# EAGLE design Canzasi-Cont (EAGLE 7.7.0)
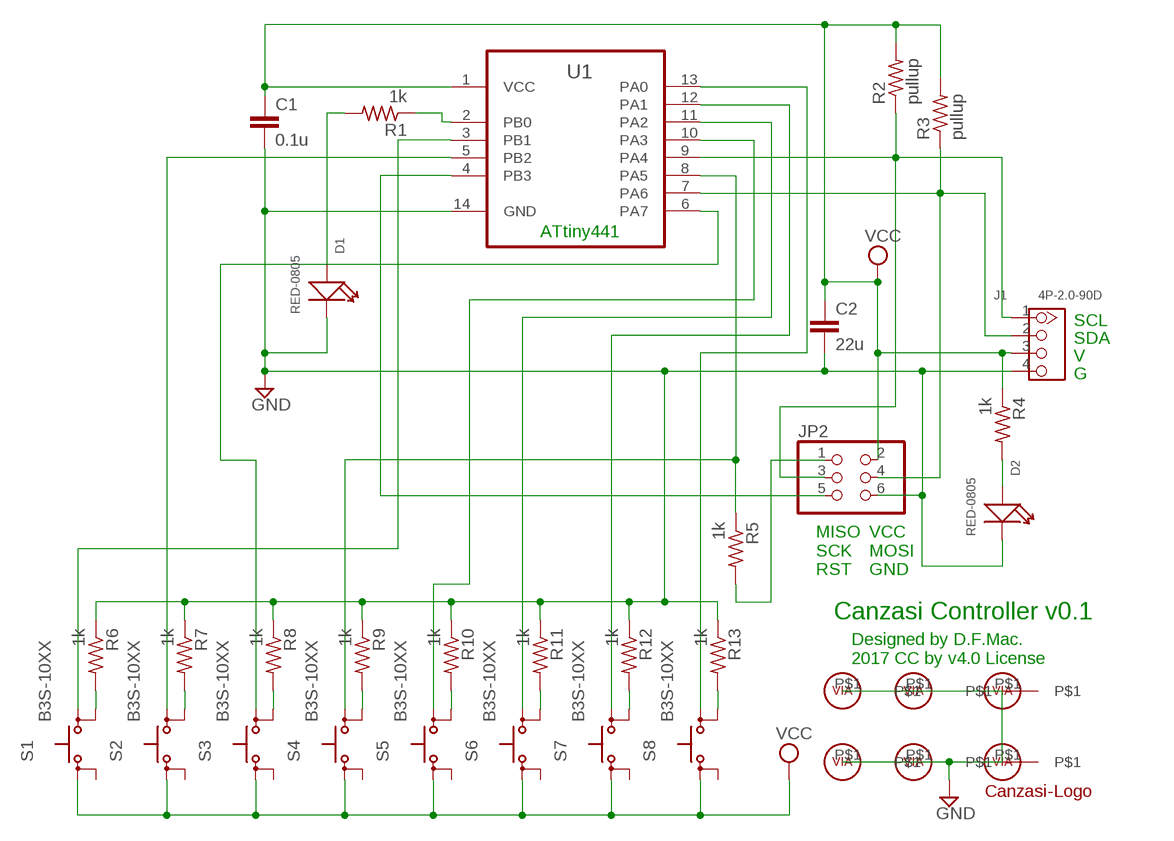
[diagram p0: schematic, sheet 1]

## Parts
C1  0.1u  C-EUC0603  [C0603]
C2  22u  C-EUC0805  [C0805]
D1  RED-0805  SMD-LED-CLEAR-RED(0805)  [LED-0805]
D2  RED-0805  SMD-LED-CLEAR-RED(0805)  [LED-0805]
J1  4P-2.0-90D  GROVE-CONNECTOR-DIP-90D(4P-2.0)  [HW4-2.0-90D]
JP2  PINHD-2X3  [2X03]
R1  1k  R-US_R0603  [R0603]
R2  pullup  R-US_R0603  [R0603]
R3  pullup  R-US_R0603  [R0603]
R4  1k  R-US_R0603  [R0603]
R5  1k  R-US_R0603  [R0603]
R6  1k  R-US_R0603  [R0603]
R7  1k  R-US_R0603  [R0603]
R8  1k  R-US_R0603  [R0603]
R9  1k  R-US_R0603  [R0603]
R10  1k  R-US_R0603  [R0603]
R11  1k  R-US_R0603  [R0603]
R12  1k  R-US_R0603  [R0603]
R13  1k  R-US_R0603  [R0603]
S1  B3S-10XX  [B3S-10XX]
S2  B3S-10XX  [B3S-10XX]
S3  B3S-10XX  [B3S-10XX]
S4  B3S-10XX  [B3S-10XX]
S5  B3S-10XX  [B3S-10XX]
S6  B3S-10XX  [B3S-10XX]
S7  B3S-10XX  [B3S-10XX]
S8  B3S-10XX  [B3S-10XX]
U1  ATTINY44A-SSU  [SOIC127P600X175-14N]
U$1  CANZASI-LOGOMEDIUM  [CANZASI-LOGO-MEDIUM]
U$2  VIA  [VIA]
U$3  VIA  [VIA]
U$4  VIA  [VIA]
U$5  VIA  [VIA]
U$6  VIA  [VIA]
U$7  VIA  [VIA]

## Nets
GND [GND]: C1.2 C2.2 D1.- D2.- J1.4 JP2.6 R6.1 R7.1 R8.1 R9.1 R10.1 R11.1 R12.1 R13.1 U1.14(GND) U$2.P$1 U$3.P$1 U$4.P$1 U$5.P$1 U$6.P$1 U$7.P$1
N$1: R1.1 U1.2(PB0)
N$2: D1.+ R1.2
N$3: J1.2 JP2.4 R3.1 U1.7(PA6)
N$4: J1.1 JP2.3 R2.1 U1.9(PA4)
N$5: S1.3(S) U1.3(PB1)
N$6: S2.3(S) U1.5(PB2)
N$7: JP2.5 U1.4(PB3)
N$8: S3.3(S) U1.6(PA7)
N$9: R5.1 S4.3(S) U1.8(PA5)
N$10: S5.3(S) U1.10(PA3)
N$11: S6.3(S) U1.11(PA2)
N$12: S7.3(S) U1.12(PA1)
N$13: S8.3(S) U1.13(PA0)
N$14: D2.+ R4.2
N$15: JP2.1 R5.2
N$16: R6.2 S1.4(S1)
N$17: R7.2 S2.4(S1)
N$18: R8.2 S3.4(S1)
N$19: R9.2 S4.4(S1)
N$20: R10.2 S5.4(S1)
N$21: R11.2 S6.4(S1)
N$22: R12.2 S7.4(S1)
N$23: R13.2 S8.4(S1)
VCC [VCC]: C1.1 C2.1 J1.3 JP2.2 R2.2 R3.2 R4.1 S1.1(P) S2.1(P) S3.1(P) S4.1(P) S5.1(P) S6.1(P) S7.1(P) S8.1(P) U1.1(VCC)
Unconnected: S1.2(P1) S2.2(P1) S3.2(P1) S4.2(P1) S5.2(P1) S6.2(P1) S7.2(P1) S8.2(P1)

## Notes on the sheet
- ATtiny441
- SCL
- SDA
- V
- G
- MISO
  SCK
  RST
- VCC
  MOSI
  GND
- Canzasi Controller v0.1
- Designed by D.F.Mac.
  2017 CC by v4.0 License

## Library data of the parts
C1 C2 = 0my:C-EU: CAPACITOR, European symbol
D1 D2 = Seeed-OPL-Diode:SMD-LED-CLEAR-RED(0805): 304090046; MPN: 17-215SURC/S530-A2/TR8
J1 = Seeed-OPL-Connector:GROVE-CONNECTOR-DIP-90D(4P-2.0): 320110034
JP2 = 0my:PINHD-2X3: PIN HEADER
R1-R13 = 0my:R-US_: RESISTOR, American symbol
S1-S8 = __switch-omron:B3S-10XX: SMD Tactile Switch
U1 = Atmel_By_element14_Batch_1-00:ATTINY44A-SSU: 8-bit Microcontroller with In-System Programmable Flash; MPN: ATTINY44A-SSU; OC_FARNELL: 1699397; OC_NEWARK: 80P3683; PACKAGE: SOIC-14; SUPPLIER: Atmel
U$1 = 1my:CANZASI-LOGO
U$2-U$7 = 0my:VIA

## Net classes
0 default: width 0.33 mm, drill 0.178 mm, clearance 0.152 mm
1 VCC: width 0.508 mm, drill 0.178 mm, clearance 0.152 mm
2 GND: width 0.508 mm, drill 0.178 mm, clearance 0.152 mm

## Board
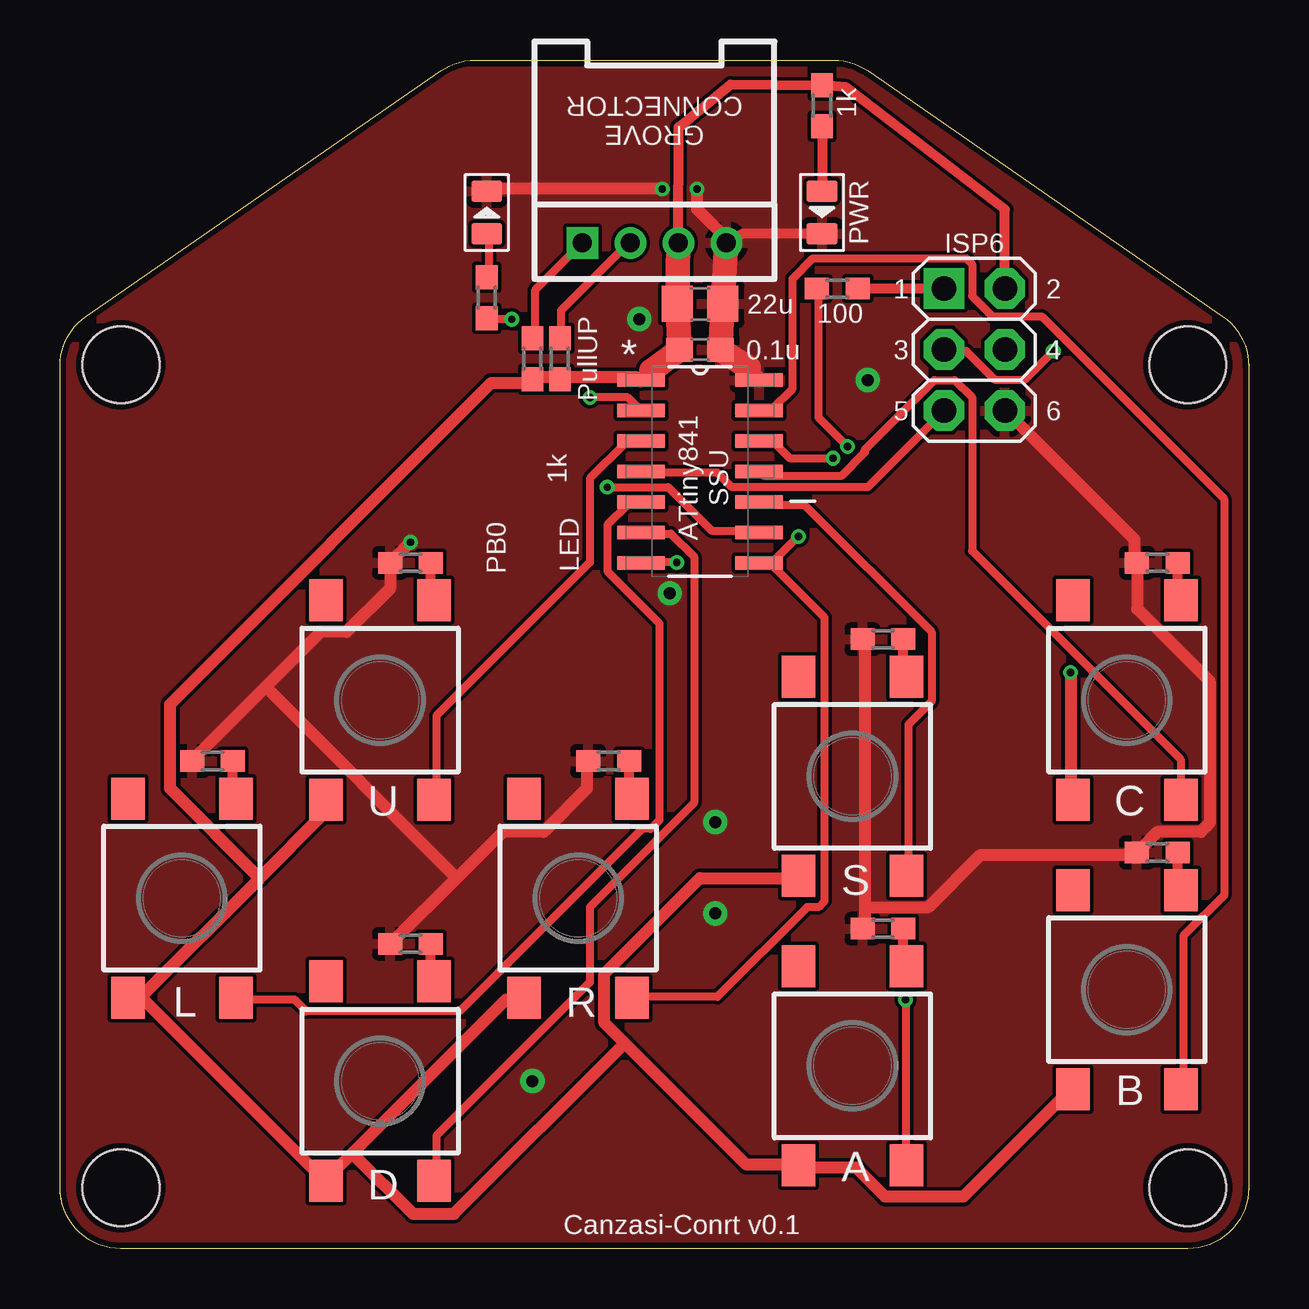
[diagram p1: board, top side]
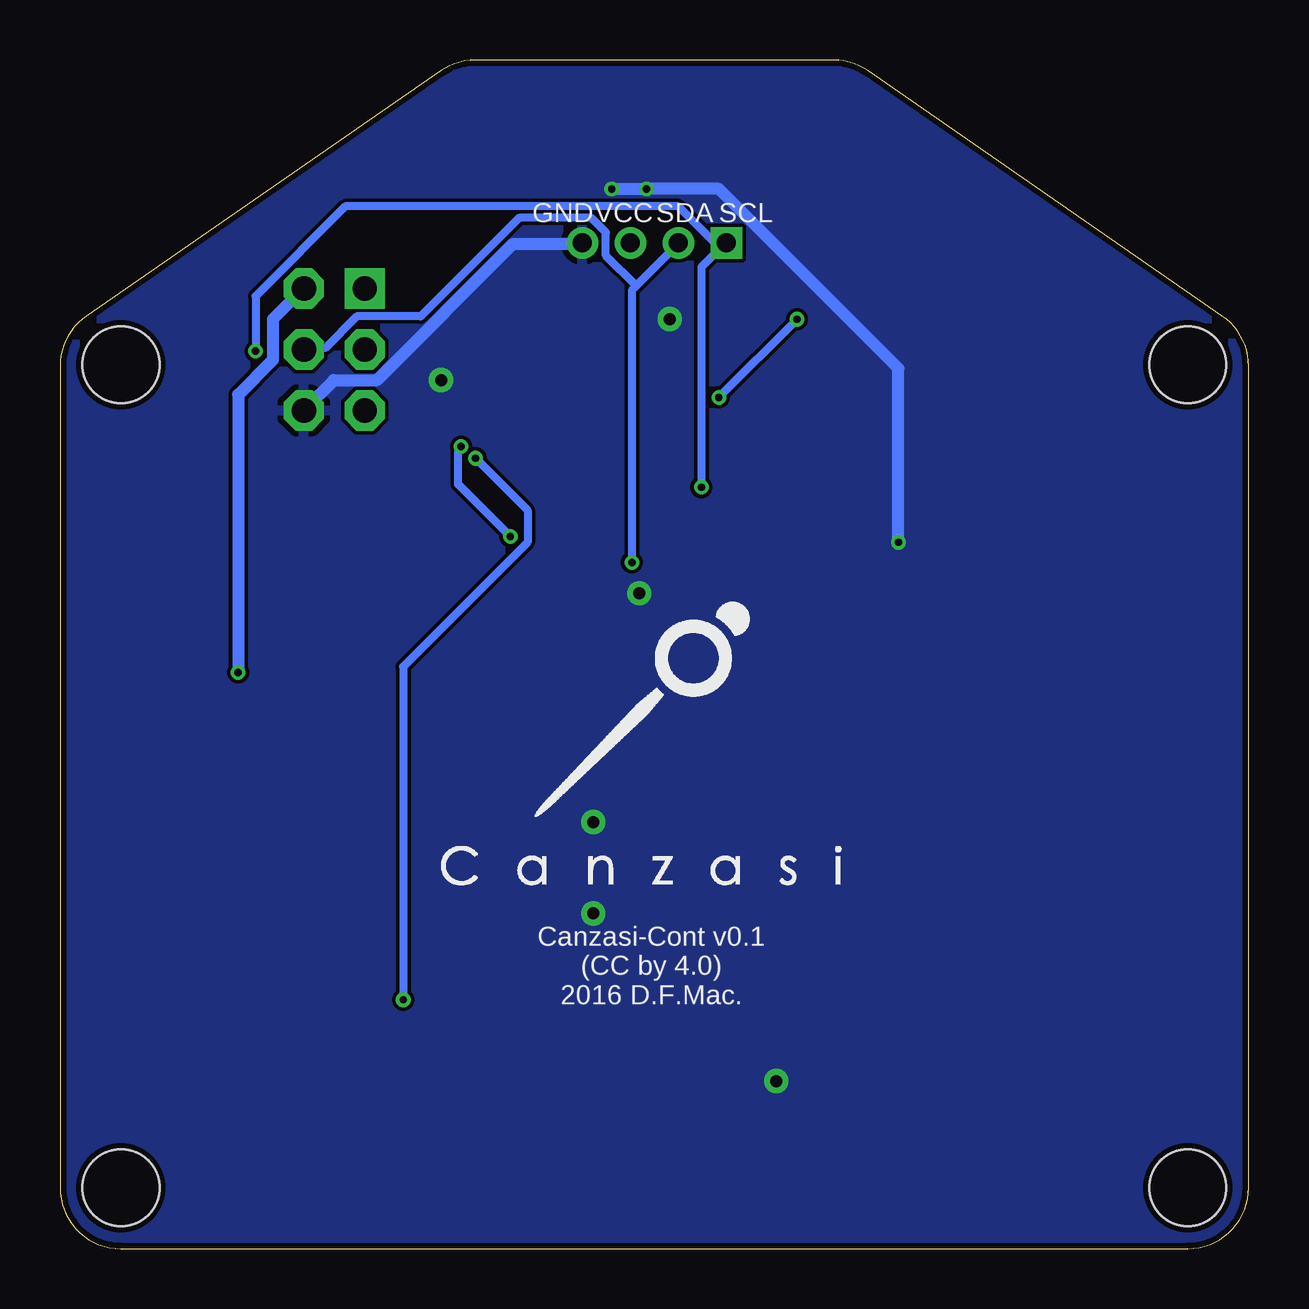
[diagram p2: board, bottom side, seen from below]

Size 49.53 x 49.53 mm. Coordinates in mm from the lower left corner, seen from the top.
Outline: 49.53,36.77 49.53,2.54 arc-90 46.99,0 2.54,0 arc-90 0,2.54 0,36.77 arc-55 1.09,38.86 15.86,49.08 arc-35 17.3,49.53 32.23,49.53 arc-35 33.67,49.08 48.44,38.86 arc-55 49.53,36.77
Copper layers (1*16): Top 0.035mm / dielectric 1.5mm / Bottom 0.035mm
Design rules "Elecrow_2-layer_eagle_rule": minimum track width 6mil, minimum drill 12mil, track to track 6mil, track to pad 6mil, pad to pad 6mil, via to via 6mil, smd to smd 0mil, copper to edge 10mil, drill to drill 10mil, minimum pad ring 10mil, minimum via ring 6mil, stop-mask expansion 2mil, vias tented up to drill 100mil, thermal gap 10mil
Holes 3.2 mm at 2.54,36.83 46.99,2.54 46.99,36.83 2.54,2.54

### Footprints (pad centres in the part's own frame; a part is rotated, then mirrored left to right if it is on the bottom)
C0603 = smd 1.1 x 1: 1 -0.85,0; 2 0.85,0
C0805 = smd 1.3 x 1.5: 1 -0.95,0; 2 0.95,0
LED-0805 = smd 0.889 x 1.27: + -0.889,0; - 0.889,0
HW4-2.0-90D = drill 0.8 pad 1.27 square: 1 -3,0 | drill 0.8 pad 1.27: 2 -1,0; 3 1,0; 4 3,0
2X03 = drill 1.016 pad 1.676 square: 1 -2.54,-1.27 | drill 1.016 pad 1.676 octagon: 2 -2.54,1.27; 3 0,-1.27; 4 0,1.27; 5 2.54,-1.27; 6 2.54,1.27
R0603 = smd 1 x 0.9: 1 -0.85,0; 2 0.85,0
B3S-10XX = smd 1.75 x 1.4: 1 -4.15,2.25; 2 4.15,2.25; 3 -4.15,-2.25; 4 4.15,-2.25
SOIC127P600X175-14N = smd 1.981 x 0.559: 1 -2.464,3.81; 2 -2.464,2.54; 3 -2.464,1.27; 4 -2.464,0; 5 -2.464,-1.27; 6 -2.464,-2.54; 7 -2.464,-3.81; 8 2.464,-3.81; 9 2.464,-2.54; 10 2.464,-1.27; 11 2.464,0; 12 2.464,1.27; 13 2.464,2.54; 14 2.464,3.81
VIA = drill 0.5 pad 0.813: P$1 0,0

### Placement (x,y rotation side)
C1  26.67,37.47 0 top
C2  26.67,39.37 0 top
D1  17.78,43.18 90 top
D2  31.75,43.18 270 top
J1  24.77,41.91 0 top
JP2  38.1,37.47 270 top
R1  17.78,39.62 90 top
R2  19.68,37.08 270 top
R3  20.83,37.08 270 top
R4  31.75,47.62 270 top
R5  32.38,40.01 0 top
R6  14.61,28.57 0 top
R7  6.35,20.32 0 top
R8  14.61,12.7 0 top
R9  22.86,20.32 0 top
R10  34.29,25.4 0 top
R11  45.72,28.57 0 top
R12  34.29,13.34 0 top
R13  45.72,16.51 0 top
S1  13.34,22.86 90 top
S2  5.08,14.61 90 top
S3  13.34,6.99 90 top
S4  21.59,14.61 90 top
S5  33.02,19.68 90 top
S6  44.45,22.86 90 top
S7  33.02,7.62 90 top
S8  44.45,10.79 90 top
U1  26.67,32.38 0 top
U$1  34.42,14.35 0 bottom
U$2  19.68,6.99 0 top
U$3  27.3,13.97 0 top
U$4  27.3,17.78 0 top
U$5  33.66,36.2 0 top
U$6  24.13,38.73 0 top
U$7  25.4,27.3 0 top

### Tracks (layer width: path | path; a pad name or v marks a point on that pad's centre or on a via)
GND  (via drill 0.3)
  Top 0.406: D2.- 28.45,42.29 J1.4
  Top 0.508: 16.53,15.44 18.46,17.37 20.15,17.37 21.96,19.18 21.96,20.27 R9.1 | 16.53,15.44 13.88,12.79 R8.1 | 8.57,23.41 10.86,25.7 11.94,25.7 13.75,27.51 13.75,28.47 R6.1 13.88,28.71 v14.6,29.44 | 8.57,23.41 5.55,20.39 R7.1 | 8.57,23.41 16.53,15.44 | 33.54,14.24 33.54,25.34 R10.1 | 33.54,14.24 33.54,13.39 R12.1 | 33.54,14.24 36.2,14.24 38.37,16.41 44.76,16.41 R13.1 45,16.65 45.73,17.37 47.54,17.37 47.9,17.74 47.9,23.65 44.88,26.66 44.88,28.35 R11.1 44.76,28.59 44.76,29.56 39.45,34.87 JP2.6 | v25.09,44.16 17.86,44.16 D1.- | v26.54,44.16 26.54,43.31 27.51,42.35 J1.4
  Top 0.61: 28.7,36.7 U1.14
  Top 1.016: J1.4 C2.2 C1.2 28.7,36.7
  Bottom 0.508: v26.54,44.16 v25.09,44.16 22.08,44.16 14.6,36.68 v14.6,29.44 | J1.4 27.87,41.87 30.64,41.87 36.32,36.2 38.12,36.2 39.33,34.99 JP2.6
  pour Top: 0,49.53 49.53,49.53 49.53,-1.27 0,-1.27
  pour Bottom: -0.64,49.53 50.16,49.53 50.16,0 -0.64,0
N$1  (via drill 0.3)
  Top 0.33: v18.82,38.73 17.86,38.73 R1.1 | v22.08,35.47 23.65,35.47 24.13,34.99 U1.2
  Bottom 0.33: v22.08,35.47 v18.82,38.73
N$2
  Top 0.33: R1.2 17.86,40.54 17.86,42.23 D1.+
N$3  (via drill 0.3)
  Top 0.33: R3.1 20.87,38.01 20.87,39.09 23.65,41.87 J1.2 | v25.7,28.59 24.25,28.59 U1.7
  Bottom 0.33: v25.7,28.59 25.7,39.94 25.52,40.12 | 25.52,40.12 23.77,41.87 J1.2 | 25.52,40.12 26.78,41.38 26.78,42.35 27.39,42.95 30.4,42.95 34.51,38.85 37.16,38.85 38.49,37.52 39.33,37.52 JP2.4
N$4  (via drill 0.3)
  Top 0.33: R2.1 19.79,38.01 19.79,39.94 21.72,41.87 J1.1 | v22.8,31.73 25.34,31.73 27.15,29.92 29.08,29.92 U1.9 | v41.38,37.4 40.18,36.2 38.97,36.2 37.76,37.4 36.92,37.4 JP2.3
  Bottom 0.33: v22.8,31.73 22.8,40.9 21.84,41.87 J1.1 22.08,41.74 23.77,43.43 37.64,43.43 41.38,39.69 v41.38,37.4
N$5
  Top 0.33: S1.3 15.68,18.82 15.68,22.2 22.08,28.59 22.08,32.09 23.53,33.54 24.13,33.54 U1.3
N$6
  Top 0.33: S2.3 7.36,10.38 9.77,10.38 10.26,9.89 16.65,9.89 24.25,17.49 24.61,17.49 24.98,17.86 24.98,26.06 22.8,28.23 22.8,30.16 23.65,31.01 24.13,31.01 U1.5
N$7
  Top 0.33: U1.4 24.25,32.33 27.39,32.33 27.99,31.73 33.66,31.73 36.8,34.87 JP2.5
N$8
  Top 0.33: S3.3 15.68,2.9 15.68,4.71 22.08,11.1 22.08,14.24 26.42,18.58 26.42,28.84 25.46,29.8 24.25,29.8 U1.6
N$9  (via drill 0.3)
  Top 0.33: v32.82,33.42 31.61,34.63 31.61,39.94 R5.1 | v30.77,29.68 29.68,28.59 29.2,28.59 U1.8 29.68,28.47 31.85,26.3 31.85,14.48 31.61,14.24 31.13,14.24 27.39,10.5 23.89,10.5 S4.3
  Bottom 0.33: v32.82,33.42 32.82,33.3 32.94,33.18 32.94,31.85 v30.77,29.68
N$10
  Top 0.33: S5.3 35.35,15.56 35.35,21.84 36.32,22.8 36.32,25.7 31.01,31.01 29.2,31.01 U1.10
N$11
  Top 0.33: S6.3 46.69,18.82 46.69,20.39 38.01,29.08 38.01,35.47 37.28,36.2 36.44,36.2 33.54,33.3 33.54,33.18 32.58,32.21 29.32,32.21 29.2,32.33 U1.11
N$12  (via drill 0.3)
  Top 0.33: v35.23,10.38 35.23,3.5 S7.3 | v32.21,32.94 30.4,32.94 29.8,33.54 29.2,33.54 U1.12
  Bottom 0.33: v35.23,10.38 35.23,24.25 30.04,29.44 30.04,30.77 v32.21,32.94
N$13
  Top 0.33: S8.3 46.81,6.76 46.81,13.03 48.5,14.72 48.5,31.25 40.9,38.85 38.85,38.85 38.01,39.69 38.01,41.02 37.76,41.26 31.37,41.26 30.52,40.42 30.52,35.83 29.68,34.99 29.2,34.99 U1.13
N$14
  Top 0.406: R4.2 D2.+
N$15
  Top 0.406: JP2.1 R5.2
N$16
  Top 0.406: S1.4 15.46,27.01 R6.2
N$17
  Top 0.406: S2.4 7.2,18.75 R7.2
N$18
  Top 0.406: S3.4 15.46,11.13 R8.2
N$19
  Top 0.406: S4.4 23.71,18.75 R9.2
N$20
  Top 0.406: S5.4 35.14,23.84 R10.2
N$21
  Top 0.406: S6.4 46.57,27.01 R11.2
N$22
  Top 0.406: S7.4 35.14,11.77 R12.2
N$23
  Top 0.406: S8.4 46.57,14.95 R13.2
VCC  (via drill 0.3)
  Top 0.406: J1.3 25.78,46.74 27.94,48.51 R4.1 32.77,48.39 39.37,43.31 JP2.2
  Top 0.508: U1.1 24.01,36.32 20.99,36.32 R3.2 20.75,36.32 19.79,36.32 R2.2 19.55,36.07 17.98,36.07 4.58,22.68 4.58,19.18 8.32,15.44 | v42.11,24.01 42.11,18.82 S6.1 | S8.1 42.11,6.64 37.64,2.17 34.38,2.17 33.18,3.38 30.89,3.38 S7.1 30.52,3.5 28.59,3.5 23.53,8.57 | 23.53,8.57 22.68,9.41 22.68,11.46 26.66,15.44 30.77,15.44 S5.1 | 12.19,3.98 11.22,3.02 S3.1 10.98,2.9 3.5,10.38 2.9,10.38 S2.1 3.5,10.62 8.32,15.44 | 12.19,3.98 18.58,10.38 19.3,10.38 S4.1 | 8.32,15.44 10.98,18.1 10.98,18.7 S1.1 | 23.53,8.57 16.41,1.45 14.72,1.45 12.19,3.98
  Top 0.61: 24.64,36.58 U1.1
  Top 1.016: J1.3 C2.1 C1.1 24.64,36.58
  Bottom 0.508: v42.11,24.01 42.11,35.59 40.66,37.04 40.66,38.73 39.45,39.94 JP2.2

### Text on the board
tNames: 1k | GROVE / CONNECTOR | PWR | ISP6 | 1 | 2 | 22u | 100 | PullUP | 0.1u | 3 | 4 | 5 | 6 | 1k | ATtiny841 | SSU | PB0 | LED | U | C | S | L | R | B | D | A | Canzasi-Conrt v0.1
bNames: SCL | SDA | VCC | GND | Canzasi-Cont v0.1 / (CC by 4.0) / 2016 D.F.Mac.